# Altium schematic sheet TP_IHM_POWER.SchDoc
size A4
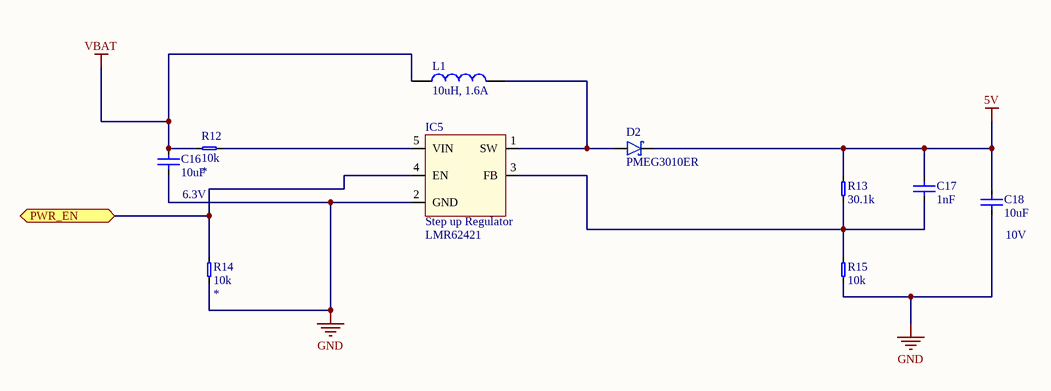
[diagram p0: TP_IHM_POWER.SchDoc]

## Parts
C16  value 10uF  Voltage/Power: 6.3V  [0402_CAP_LD]  (hidden comment: CerCap)
C17  value 1nF  [0402_CAP_LD]  (hidden comment: CerCap)
C18  value 10uF  Voltage/Power: 10V  [0402_CAP_LD]  (hidden comment: CerCap)
D2  PMEG3010ER  [SOD123W]
IC5  Step up Regulator  [LMR62421]
L1  10uH, 1.6A  [INDUCTOR_WE-LQS_5020]
R12  value 10k  [0603_RES_LD]  (hidden comment: Resistor)
R13  value 30.1k  [0603_RES_LD]  (hidden comment: Resistor)
R14  value 10k  [0603_RES_LD]  (hidden comment: Resistor)
R15  value 10k  [0603_RES_LD]  (hidden comment: Resistor)

## Ports
PWR_EN

## Nets
5V: C17.2 C18.2 D2.K R13.2
GND: C16.1 C18.1 IC5.2(GND) R14.1 R15.1
VBAT: C16.2 L1.1 R12.1
PWR_EN: IC5.4(EN) R14.2 ; port PWR_EN
NetC17_1: C17.1 IC5.3(FB) R13.1 R15.2
NetD2_A: D2.A IC5.1(SW) L1.2
NetIC5_5: IC5.5(VIN) R12.2

## Library data of the parts
C16-C18 = CerCap: Ceramic Capacitor; Type: *; Package: *
  C17: Voltage/Power: *
D2 = Schottky_PMEG3010ER: Nexperia 1A low Vf Mega Schottky barrier rectifier; Reference: PMEG3010ER
IC5 = LMR62421XMF: LMR62421 simple switcher 24 Vout stepup voltage SOT-23; Reference: LMR62421
L1 = INDUCTOR_74404052100: WE-LQS SMD Power Inductor, size 5020, 10uH, 1.6A; DC Resistance: 109mOhm; Inductance Tolerance: +/-20%; Saturation Current: 1.95A; Self Resonant Frequency: 37MHz; ComponentLink1Description: Manufacturer; ComponentLink1URL: http://www.we-online.de; ComponentLink2Description: Datasheet; ComponentLink2URL: https://katalog.we-online.com/pbs/datasheet/74404052100.pdf; Part Number: 74404052100; Published Date: May 2019; Publisher: Wurth Elektronik; Rated Current: 1.6A; Inductance: 10uH; Operating Temperature: -40 to +125degC; Mounting Technology: SMT; Packaging: Tape and Reel; DC Resistance Tolerance: +/-20%; Size: 5020; Reference: 74404052100
R12-R15 = Resistor: Precision: *; Package: *